# EAGLE design sioboard (EAGLE 9.4.2)
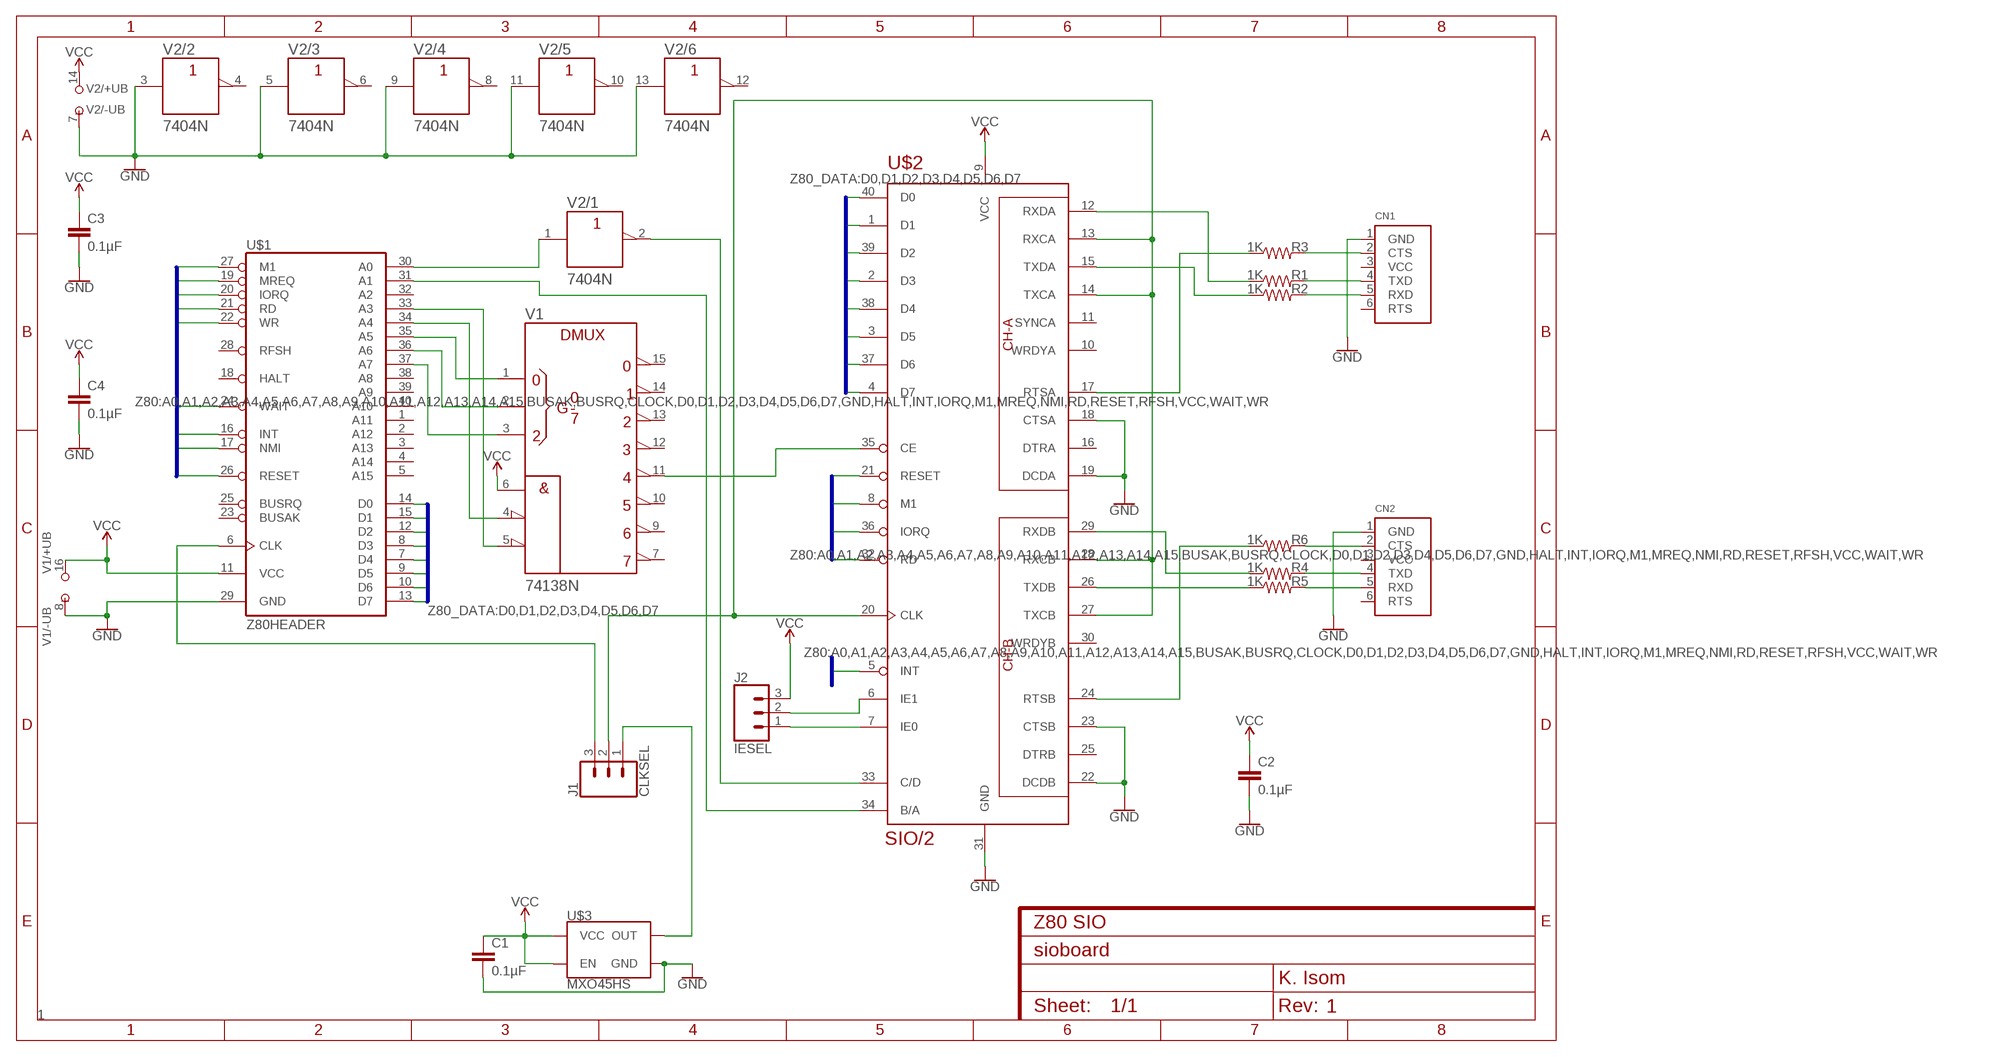
[diagram p0: schematic, sheet 1]
FRAME1 (FRAME-A4L): CNAME: Z80 SIO; CREVISION: 1; DESIGNER: K. Isom; REV: 1

## Parts
C1  0.1µF  C2,5-3  [C2.5-3]
C2  0.1µF  C2,5-3  [C2.5-3]
C3  0.1µF  C2,5-3  [C2.5-3]
C4  0.1µF  C2,5-3  [C2.5-3]
CN1  FTDIUSBCABLE  [1X06_ROUND]
CN2  FTDIUSBCABLE  [1X06_ROUND]
J1  CLKSEL  CONN_03  [1X03]
J2  IESEL  CONN_03  [1X03]
R1  1K  RESISTORAXIAL-0.3  [AXIAL-0.3]
R2  1K  RESISTORAXIAL-0.3  [AXIAL-0.3]
R3  1K  RESISTORAXIAL-0.3  [AXIAL-0.3]
R4  1K  RESISTORAXIAL-0.3  [AXIAL-0.3]
R5  1K  RESISTORAXIAL-0.3  [AXIAL-0.3]
R6  1K  RESISTORAXIAL-0.3  [AXIAL-0.3]
U$1  Z80HEADER  [2X20]
U$2  SIO/2  [DIL40]
U$3  MXO45HS  [DIL08-HALF]
V1  74138N  [DIL16]
V2  7404N  [DIL14]

## Nets
D0: U$1.14(D0) U$2.40(D0)
D1: U$1.15(D1) U$2.1(D1)
D2: U$1.12(D2) U$2.39(D2)
D3: U$1.8(D3) U$2.2(D3)
D4: U$1.7(D4) U$2.38(D4)
D5: U$1.9(D5) U$2.3(D5)
D6: U$1.10(D6) U$2.37(D6)
D7: U$1.13(D7) U$2.4(D7)
GND: C1.2 C2.2 C3.2 C4.2 CN1.1(GND) CN2.1(GND) U$1.29(GND) U$2.18(CTSA) U$2.19(DCDA) U$2.22(DCDB) U$2.23(CTSB) U$2.31(GND) U$3.4(GND) V1.8(-UB) V2.3(/2:A) V2.5(/3:A) V2.7(/-UB:-UB) V2.9(/4:A) V2.11(/5:A) V2.13(/6:A)
INT: U$1.16(INT) U$2.5(INT)
IORQ: U$1.20(IORQ) U$2.36(IORQ)
M1: U$1.27(M1) U$2.8(M1)
MREQ: U$1.19(MREQ)
N$1: J1.1 U$3.5(OUT)
N$2: J1.2 U$2.13(RXCA) U$2.14(TXCA) U$2.20(CLK) U$2.27(TXCB) U$2.28(RXCB)
N$3: J1.3 U$1.6(CLK)
N$4: U$1.37(A7) V1.3(C)
N$5: U$1.36(A6) V1.2(B)
N$6: U$1.35(A5) V1.1(A)
N$7: U$1.34(A4) V1.4(!G2A)
N$8: U$1.33(A3) V1.5(!G2B)
N$9: U$2.35(CE) V1.11(Y4)
N$10: U$1.31(A1) U$2.34(B/A)
N$11: U$1.30(A0) V2.1(/1:A)
N$12: U$2.33(C/D) V2.2(/1:Y)
N$13: CN1.2(CTS) R3.P$2
N$14: CN1.4(TXD) R1.P$2
N$15: CN1.5(RXD) R2.P$2
N$16: R2.P$1 U$2.15(TXDA)
N$17: R1.P$1 U$2.12(RXDA)
N$18: R3.P$1 U$2.17(RTSA)
N$19: R4.P$1 U$2.29(RXDB)
N$20: R5.P$1 U$2.26(TXDB)
N$21: CN2.5(RXD) R5.P$2
N$22: CN2.4(TXD) R4.P$2
N$23: R6.P$1 U$2.24(RTSB)
N$24: CN2.2(CTS) R6.P$2
N$25: J2.1 U$2.7(IE0)
N$26: J2.2 U$2.6(IE1)
NMI: U$1.17(NMI)
RD: U$1.21(RD) U$2.32(RD)
RESET: U$1.26(RESET) U$2.21(RESET)
VCC: C1.1 C2.1 C3.1 C4.1 J2.3 U$1.11(VCC) U$2.9(VCC) U$3.1(EN) U$3.8(VCC) V1.6(G1) V1.16(+UB) V2.14(/+UB:+UB)
WAIT: U$1.24(WAIT)
WR: U$1.22(WR)
Unconnected: CN1.3(VCC) CN1.6(RTS) CN2.3(VCC) CN2.6(RTS) U$1.1(A11) U$1.2(A12) U$1.3(A13) U$1.4(A14) U$1.5(A15) U$1.18(HALT) U$1.23(BUSAK) U$1.25(BUSRQ) U$1.28(RFSH) U$1.32(A2) U$1.38(A8) U$1.39(A9) U$1.40(A10) U$2.10(WRDYA) U$2.11(SYNCA) U$2.16(DTRA) U$2.25(DTRB) U$2.30(WRDYB) V1.7(Y7) V1.9(Y6) V1.10(Y5) V1.12(Y3) V1.13(Y2) V1.14(Y1) V1.15(Y0) V2.4(/2:Y) V2.6(/3:Y) V2.8(/4:Y) V2.10(/5:Y) V2.12(/6:Y)

## Buses
Z80:A0,A1,A2,A3,A4,A5,A6,A7,A8,A9,A10,A11,A12,A13,A14,A15,BUSAK,BUSRQ,CLOCK,D0,D1,D2,D3,D4,D5,D6,D7,GND,HALT,INT,IORQ,M1,MREQ,NMI,RD,RESET,RFSH,VCC,WAIT,WR
Z80_DATA:D0,D1,D2,D3,D4,D5,D6,D7

## Library data of the parts
C1-C4 = capacitor-wima:C: CAPACITOR naming: grid - package width
CN1 CN2 = microbuilder:FTDIUSBCABLE: FTDI TTL-232R USB Cable Connector for FTDI's USB->RS232 Cable
J1 J2 = SparkFun-Connectors:CONN_03: Multi connection point. Often used as Generic Header-pin footprint for 0.1 inch spaced/style header connections On any of the 0.1 inch spaced packages, you can populate with these: Break Away Headers - Straight <https://www.sparkfun.com/products/116> (PRT-00116) Break Away Male Headers - Right Angle <https://www.sparkfun.com/products/553> (PRT-00553) Female Headers <https://www.sparkfun.com/products/115> (PRT-00115) Break Away Headers - Machine Pin <https://www.sparkfun.com/products/117> (PRT-00117) Break Away Female Headers - Swiss Machine Pin <https://www.sparkfun.com/products/743> (PRT-00743) Stackable Header - 3 Pin (Female, 0.1") <https://www.sparkfun.com/products/13875> (PRT-13875) For SCREWTERMINALS and SPRING TERMINALS visit here: Screw Terimnals on SparkFun.com <https://www.sparkfun.com/search/results?term=Screw+Terminals> (5mm/3.5mm/2.54mm spacing) This device is also useful as a general connection point to wire up your design to another part of your project. Our various solder wires solder well into these plated through hole pads. Hook-Up Wire - Assortment (Stranded, 22 AWG) <https://www.sparkfun.com/products/11375> (PRT-11375) Hook-Up Wire - Assortment (Solid Core, 22 AWG) <https://www.sparkfun.com/products/11367> (PRT-11367) View the entire wire category on our website here <https://www.sparkfun.com/categories/141> Special notes: Molex polarized connector foot print use with SKU : PRT-08232 with associated crimp pins and housings.; PROD_ID: XXX-00000; VALUE: 455-1750-1-ND
R1-R6 = SparkFun-Resistors:RESISTOR: Generic Resistor Package
U$1 = wntrmute:Z80
U$2 = wntrmute:SIO/2
U$3 = wntrmute:MXO45HS
V1 = 74ttl-din:74*138: 3-line to 8-line DECODER/DEMULTIPLEXER
V2 = 74ttl-din:74*04: Hex INVERTER

## Net classes
0 default: width 0.152 mm, drill 0.254 mm, clearance 0.152 mm

## Board
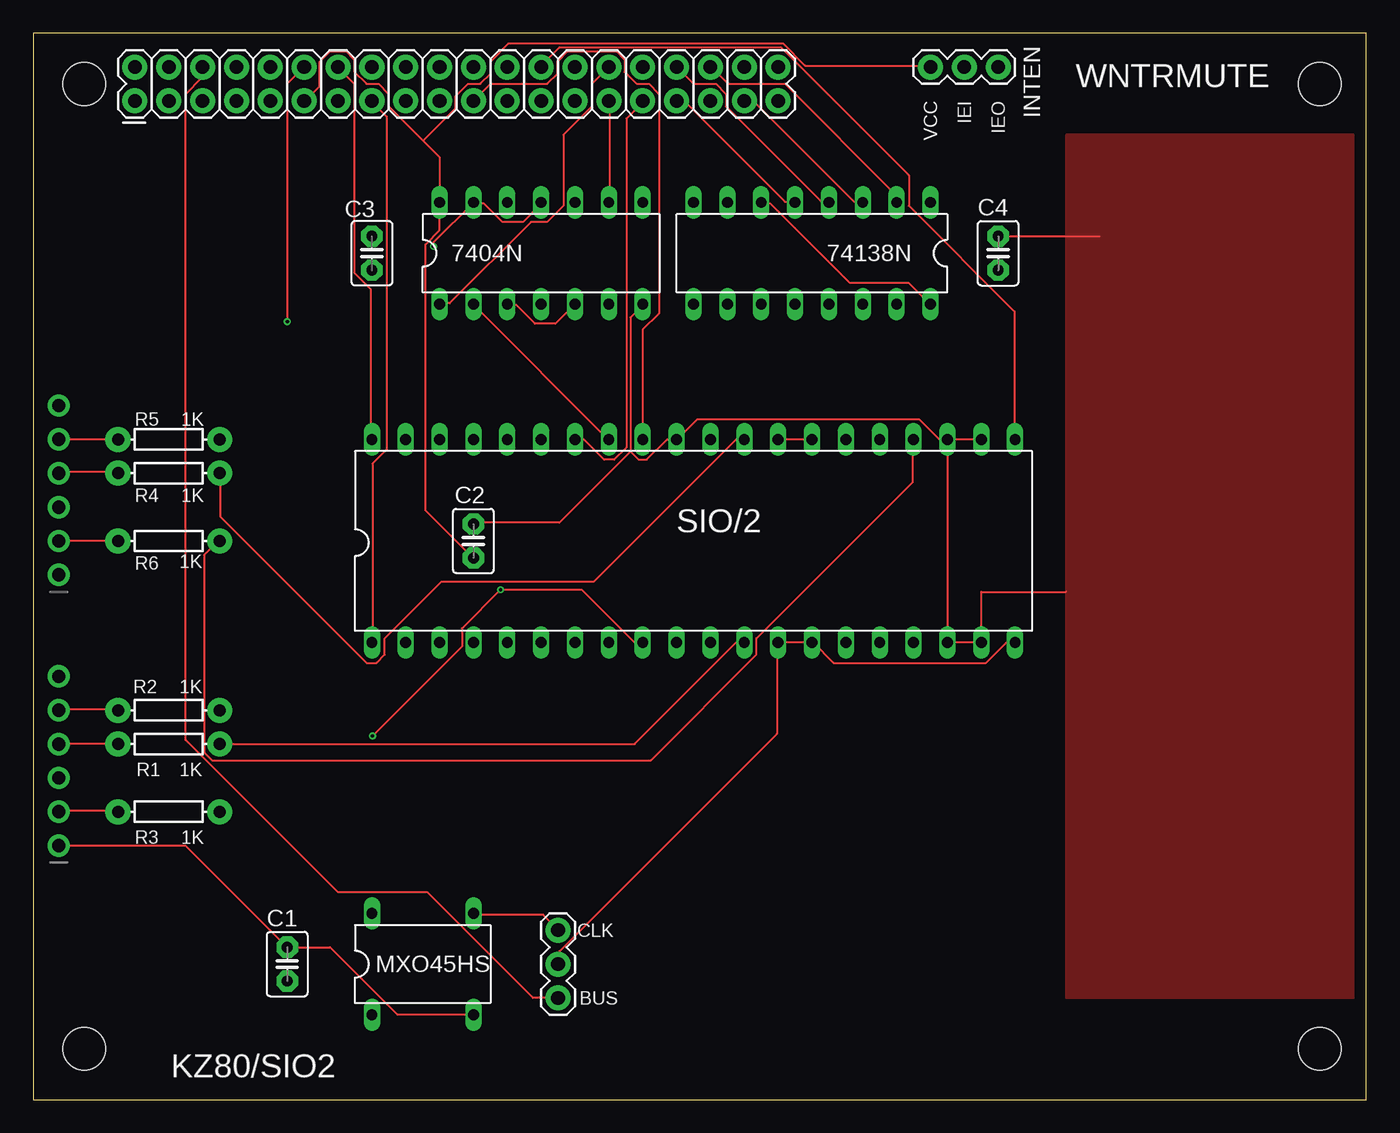
[diagram p1: board, top side]
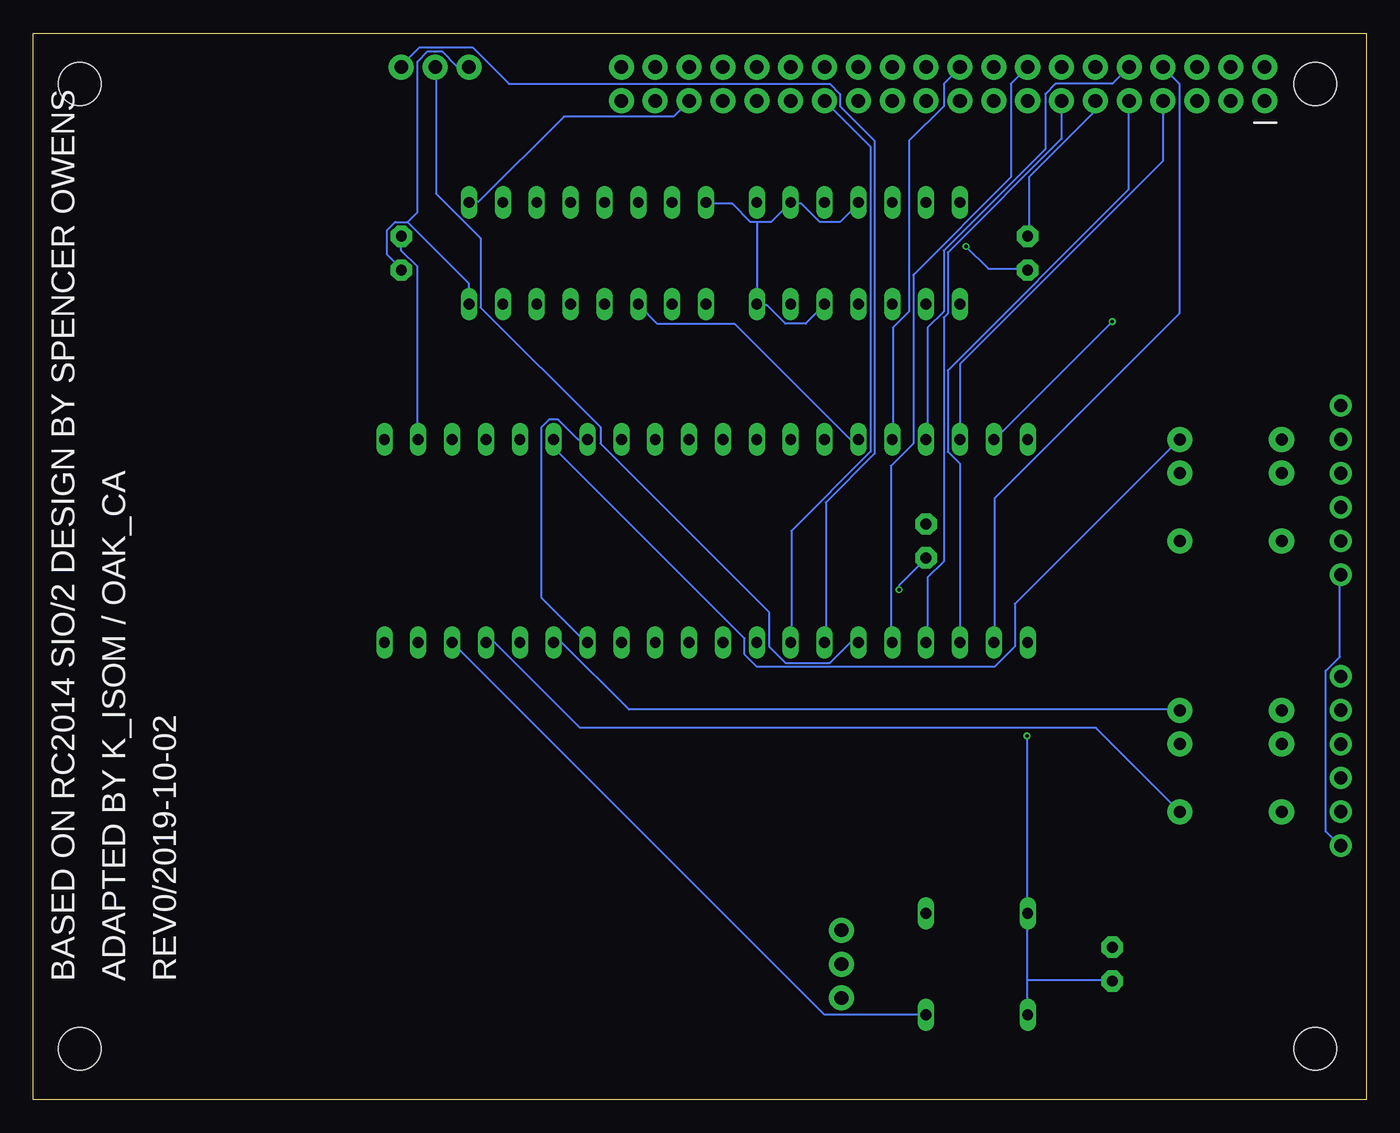
[diagram p2: board, bottom side, seen from below]

Size 100 x 80 mm. Coordinates in mm from the lower left corner, seen from the top.
Outline: 0,0 100,0 100,80 0,80 0,0
Copper layers (1*16): Top 0.035559375mm / dielectric 1.6mm / Bottom 0.035559375mm
Design rules "oshpark-2layer": minimum track width 6mil, minimum drill 10mil, track to track 6mil, track to pad 6mil, pad to pad 6mil, via to via 6mil, smd to smd 6mil, copper to edge 15mil, drill to drill 6mil, minimum pad ring 5mil, minimum via ring 5mil, stop-mask expansion 2.5mil, vias tented up to drill 0mil, thermal gap 10mil
Holes 3.2 mm at 3.81,76.2 96.52,76.2 96.52,3.81 3.81,3.81

### Footprints (pad centres in the part's own frame; a part is rotated, then mirrored left to right if it is on the bottom)
C2.5-3 = drill 0.813 pad 1.6 octagon: 1 -1.27,0; 2 1.27,0
1X06_ROUND = drill 1 pad 1.676: 1 -6.35,0; 2 -3.81,0; 3 -1.27,0; 4 1.27,0; 5 3.81,0; 6 6.35,0
1X03 = drill 1.016 pad 1.88: 1 0,0; 2 2.54,0; 3 5.08,0
AXIAL-0.3 = drill 0.9 pad 1.88: P$1 -3.81,0; P$2 3.81,0
2X20 = drill 1.016 pad 1.88: 1 0,0; 2 0,2.54; 3 2.54,0; 4 2.54,2.54; 5 5.08,0; 6 5.08,2.54; 7 7.62,0; 8 7.62,2.54; 9 10.16,0; 10 10.16,2.54; 11 12.7,0; 12 12.7,2.54; 13 15.24,0; 14 15.24,2.54; 15 17.78,0; 16 17.78,2.54; 17 20.32,0; 18 20.32,2.54; 19 22.86,0; 20 22.86,2.54; 21 25.4,0; 22 25.4,2.54; 23 27.94,0; 24 27.94,2.54; 25 30.48,0; 26 30.48,2.54; 27 33.02,0; 28 33.02,2.54; 29 35.56,0; 30 35.56,2.54; 31 38.1,0; 32 38.1,2.54; 33 40.64,0; 34 40.64,2.54; 35 43.18,0; 36 43.18,2.54; 37 45.72,0; 38 45.72,2.54; 39 48.26,0; 40 48.26,2.54
DIL40 = drill 0.813 long: 1 -24.13,-7.62; 2 -21.59,-7.62; 3 -19.05,-7.62; 4 -16.51,-7.62; 5 -13.97,-7.62; 6 -11.43,-7.62; 7 -8.89,-7.62; 8 -6.35,-7.62; 9 -3.81,-7.62; 10 -1.27,-7.62; 11 1.27,-7.62; 12 3.81,-7.62; 13 6.35,-7.62; 14 8.89,-7.62; 15 11.43,-7.62; 16 13.97,-7.62; 17 16.51,-7.62; 18 19.05,-7.62; 19 21.59,-7.62; 20 24.13,-7.62; 21 24.13,7.62; 22 21.59,7.62; 23 19.05,7.62; 24 16.51,7.62; 25 13.97,7.62; 26 11.43,7.62; 27 8.89,7.62; 28 6.35,7.62; 29 3.81,7.62; 30 1.27,7.62; 31 -1.27,7.62; 32 -3.81,7.62; 33 -6.35,7.62; 34 -8.89,7.62; 35 -11.43,7.62; 36 -13.97,7.62; 37 -16.51,7.62; 38 -19.05,7.62; 39 -21.59,7.62; 40 -24.13,7.62
DIL08-HALF = drill 0.813 long: 1 -3.81,-3.81; 4 3.81,-3.81; 5 3.81,3.81; 8 -3.81,3.81
DIL16 = drill 0.813 long: 1 -8.89,-3.81; 2 -6.35,-3.81; 3 -3.81,-3.81; 4 -1.27,-3.81; 5 1.27,-3.81; 6 3.81,-3.81; 7 6.35,-3.81; 8 8.89,-3.81; 9 8.89,3.81; 10 6.35,3.81; 11 3.81,3.81; 12 1.27,3.81; 13 -1.27,3.81; 14 -3.81,3.81; 15 -6.35,3.81; 16 -8.89,3.81
DIL14 = drill 0.813 long: 1 -7.62,-3.81; 2 -5.08,-3.81; 3 -2.54,-3.81; 4 0,-3.81; 5 2.54,-3.81; 6 5.08,-3.81; 7 7.62,-3.81; 8 7.62,3.81; 9 5.08,3.81; 10 2.54,3.81; 11 0,3.81; 12 -2.54,3.81; 13 -5.08,3.81; 14 -7.62,3.81

### Placement (x,y rotation side)
C1  19.05,10.16 90 top
C2  33.02,41.91 90 top
C3  25.4,63.5 270 top
C4  72.39,63.5 90 top
CN1  1.91,25.4 90 top
CN2  1.91,45.72 90 top
J1  39.37,12.7 270 top
J2  72.39,77.47 180 top
R1  10.16,26.67 180 top
R2  10.16,29.21 180 top
R3  10.16,21.59 180 top
R4  10.16,46.99 180 top
R5  10.16,49.53 180 top
R6  10.16,41.91 180 top
U$1  7.62,74.93 0 top
U$2  49.53,41.91 0 top
U$3  29.21,10.16 0 top
V1  58.42,63.5 180 top
V2  38.1,63.5 0 top

### Tracks (layer width: path | path; a pad name or v marks a point on that pad's centre or on a via)
D0
  Top 0.152: U$2.40 25.3,49.53 25.3,60.81 24.08,62.03 24.08,76.2 22.86,77.42 U$1.14
D1
  Top 0.152: U$2.1 25.45,34.29 25.45,47.7 26.52,48.77 26.52,73.76 25.45,74.83 U$1.15
D2  (via drill 0.25)
  Top 0.152: v19.05,58.37 19.05,76.2 U$1.12
  Bottom 0.152: v19.05,58.37 27.89,49.53 U$2.39
D3
  Bottom 0.152: U$2.2 27.89,34.29 27.89,45.11 14.02,58.98 14.02,76.2 15.24,77.42 U$1.8
D4
  Bottom 0.152: U$2.38 30.48,55.17 15.24,70.41 U$1.7
D5
  Bottom 0.152: U$2.3 30.48,47.7 31.39,48.62 31.39,54.71 17.83,68.28 17.83,74.83 U$1.9
D6
  Bottom 0.152: U$1.10 19.05,76.2 23.32,76.2 24.08,75.44 24.08,71.32 31.7,63.7 31.7,59.13 32.92,57.91 32.92,49.53 U$2.37
D7
  Bottom 0.152: U$1.13 22.86,72.08 31.39,63.55 31.39,58.98 31.7,58.67 31.7,40.39 32.92,39.17 32.92,34.29 U$2.4
GND  (via drill 0.25)
  Top 0.152: U$3.4 32.92,6.4 27.28,6.4 22.25,11.43 C1.2 11.43,19.05 CN1.1 | U$2.22 U$2.23 | U$2.23 U$2.18 U$2.19 71.12,38.1 77.47,38.1 | V2.5 39.17,58.22 37.64,58.22 36.27,59.59 35.66,59.59 V2.3 | 44.81,48.62 45.41,48.01 46.02,48.01 47.55,49.53 U$2.31 48.31,49.53 49.84,51.05 66.45,51.05 67.97,49.53 U$2.23 | 44.81,48.62 44.81,58.67 45.72,59.59 V2.7 | 44.81,48.62 39.47,43.28 33.07,43.28 C2.2 | V2.11 38.1,67.21 36.73,65.84 35.2,65.84 33.83,67.21 33.07,67.21 V2.13 30.02,64.31 v30.02,64.01 | U$1.29 43.28,74.83 43.28,67.36 V2.9 | C4.2 80.01,64.77
  Bottom 0.152: CN2.1 1.98,39.32 1.98,33.22 3.05,32.16 3.05,20.12 1.98,19.05 CN1.1 | C4.2 72.39,63.7 71.17,62.48 71.17,49.53 U$2.22 | V2.5 40.69,59.59 42.06,58.22 43.59,58.22 44.96,59.59 45.72,59.59 V2.7 45.72,65.84 | V2.11 38.1,67.21 39.47,65.84 41,65.84 42.37,67.21 43.13,67.21 V2.9 44.65,65.84 45.72,65.84 | 45.72,65.84 46.18,65.84 47.55,67.21 49.53,67.21 V1.8 | v30.02,64.01 28.35,62.33 25.45,62.33 C3.2 | U$2.18 40.69,6.4 33.07,6.4 U$3.4
  pour Top: 77.47,7.62 99.06,7.62 99.06,72.39 77.47,72.39
INT
  Bottom 0.152: U$1.16 26.67,76.2 26.67,69.19 33.98,61.87 33.98,49.23 35.66,47.55 35.66,34.29 U$2.5
IORQ
  Bottom 0.152: U$2.36 35.51,49.53 35.51,57.91 34.29,59.13 34.29,71.93 31.7,74.52 31.7,76.2 30.48,77.42 U$1.20
M1
  Bottom 0.152: U$1.27 37.19,71.48 37.19,48.62 43.13,42.67 43.13,34.29 U$2.8
N$1
  Top 0.152: U$3.5 33.07,13.87 38.25,13.87 39.32,12.8 J1.1
N$2
  Top 0.152: U$2.27 U$2.28 | U$2.20 73,34.29 71.48,32.77 60.05,32.77 58.52,34.29 U$2.14 U$2.13 55.78,34.29 55.78,27.43 39.47,11.12 39.47,10.21 J1.2
  Bottom 0.152: U$2.27 59.13,49.53 60.66,51.05 61.27,51.05 61.87,50.44 61.87,37.64 58.52,34.29 U$2.14
N$3
  Top 0.152: J1.3 37.49,7.62 29.57,15.54 22.86,15.54 11.43,26.98 11.43,75.44 12.65,76.66 12.65,77.42 U$1.6
N$4
  Top 0.152: V1.3 62.18,67.36 61.57,67.36 54.1,74.83 53.34,74.83 U$1.37
N$5
  Top 0.152: V1.2 64.77,67.82 56.39,76.2 52.12,76.2 50.9,77.42 U$1.36
N$6
  Bottom 0.152: U$1.35 51.97,73.76 60.2,73.76 66.6,67.36 67.21,67.36 V1.1
N$7
  Top 0.152: U$1.34 49.53,76.2 51.21,76.2 51.97,75.44 51.97,74.52 59.13,67.36 59.59,67.36 V1.4
N$8
  Top 0.152: V1.5 57.15,67.36 56.39,67.36 48.92,74.83 48.31,74.83 U$1.33
N$9
  Bottom 0.152: U$2.35 38.71,49.53 47.4,58.22 53.19,58.22 54.56,59.59 V1.11
N$10
  Top 0.152: U$2.34 41.3,49.53 42.82,48.01 43.59,48.01 44.5,48.92 44.5,73.61 45.72,74.83 U$1.31
N$11
  Top 0.152: U$1.30 41.91,76.2 41.91,74.52 39.78,72.39 39.78,67.06 38.56,65.84 37.34,65.84 31.24,59.74 30.48,59.74 V2.1
N$12
  Top 0.152: V2.2 33.07,59.59 43.13,49.53 U$2.33
N$13
  Top 0.152: CN1.2 1.98,21.64 6.25,21.64 R3.P$2
N$14
  Top 0.152: R1.P$2 CN1.4
N$15
  Top 0.152: CN1.5 1.98,29.26 6.25,29.26 R2.P$2
N$16
  Bottom 0.152: U$2.15 60.35,34.29 55.32,29.26 14.02,29.26 R2.P$1
N$17
  Top 0.152: U$2.12 52.73,34.29 45.11,26.67 R1.P$1
N$18
  Bottom 0.152: U$2.17 65.38,34.29 58.98,27.89 20.27,27.89 R3.P$1
N$19
  Top 0.152: U$2.29 52.73,49.53 42.06,38.86 30.63,38.86 26.36,34.59 26.36,33.38 25.76,32.77 24.99,32.77 14.02,43.74 14.02,46.94 R4.P$1
N$20
  Bottom 0.152: U$2.26 60.96,48.92 46.63,34.59 46.63,33.38 45.72,32.46 27.89,32.46 26.36,33.98 26.36,37.19 14.02,49.53 R5.P$1
N$21
  Top 0.152: R5.P$2 CN2.5
N$22
  Top 0.152: CN2.4 1.98,47.09 6.25,47.09 R4.P$2
N$23
  Top 0.152: U$2.24 65.99,49.53 65.99,46.33 54.25,34.59 54.25,33.38 46.33,25.45 13.41,25.45 12.8,26.06 12.8,40.84 13.87,41.91 R6.P$1
N$24
  Top 0.152: R6.P$2 CN2.2
N$25
  Bottom 0.152: U$2.7 40.54,34.29 40.54,44.81 36.88,48.46 36.88,71.93 39.47,74.52 39.47,75.44 40.23,76.2 64.31,76.2 67.06,78.94 71.02,78.94 72.39,77.57 J2.1
N$26
  Bottom 0.152: U$2.6 38.71,34.29 40.23,32.77 43.59,32.77 44.81,33.98 44.81,36.58 57.45,49.23 57.45,50.44 66.45,59.44 66.45,64.62 69.8,67.97 69.8,77.42 J2.2
RD
  Top 0.152: U$2.32 45.72,57.76 46.94,58.98 46.94,75.44 46.18,76.2 45.26,76.2 44.35,77.11 44.35,78.03 43.74,78.64 40.08,78.64 39.32,77.88 39.32,76.96 38.56,76.2 34.29,76.2 U$1.21
RESET
  Top 0.152: U$2.21 73.61,49.53 73.61,59.13 65.68,67.06 65.68,69.34 56.08,78.94 39.47,78.94 38.1,77.57 U$1.26
VCC  (via drill 0.25)
  Top 0.152: V1.6 54.71,67.21 55.32,67.21 61.27,61.27 65.68,61.27 67.21,59.74 V1.16 | 29.26,71.93 26.67,74.52 26.67,75.44 25.91,76.2 24.99,76.2 24.08,77.11 24.08,78.03 23.47,78.64 22.25,78.64 21.49,77.88 21.49,76.05 20.42,74.98 U$1.11 | 29.26,71.93 30.48,70.71 V2.14 30.48,65.23 29.41,64.16 29.41,44.2 32.92,40.69 C2.1 | U$2.9 45.11,34.29 41.15,38.25 v35.05,38.25 32.16,35.36 32.16,33.98 v25.45,27.28 | 29.26,71.93 31.7,74.37 31.7,75.29 32.61,76.2 33.53,76.2 34.29,76.96 34.29,77.88 35.66,79.25 56.24,79.25 57.91,77.57 67.21,77.57 J2.3
  Bottom 0.152: 71.93,65.84 67.36,61.27 67.36,59.74 V1.16 | 71.93,65.84 72.85,65.84 73.46,65.23 73.46,63.4 72.39,62.33 C4.1 | 71.93,65.84 71.17,66.6 71.17,77.88 70.41,78.64 69.34,78.64 68.28,77.57 67.36,77.57 J2.3 | C3.1 25.3,64.77 25.3,69.19 20.42,74.07 20.42,74.83 U$1.11 | 25.45,8.99 25.45,13.87 U$3.8 25.45,14.02 v25.45,27.28 | 25.45,8.99 25.45,6.4 U$3.1 | 25.45,8.99 19.05,8.99 C1.1 | v35.05,38.25 35.05,38.56 33.07,40.54 C2.1

### Text on the board
tPlace: WNTRMUTE | VCC | IEI | IEO | INTEN | CLK | BUS | KZ80/SIO2
bPlace: REV0/2019-10-02 | ADAPTED BY K_ISOM / OAK_CA | BASED ON RC2014 SIO/2 DESIGN BY SPENCER OWENS